# EAGLE design Fingerprint_UP_app (EAGLE 5.04)
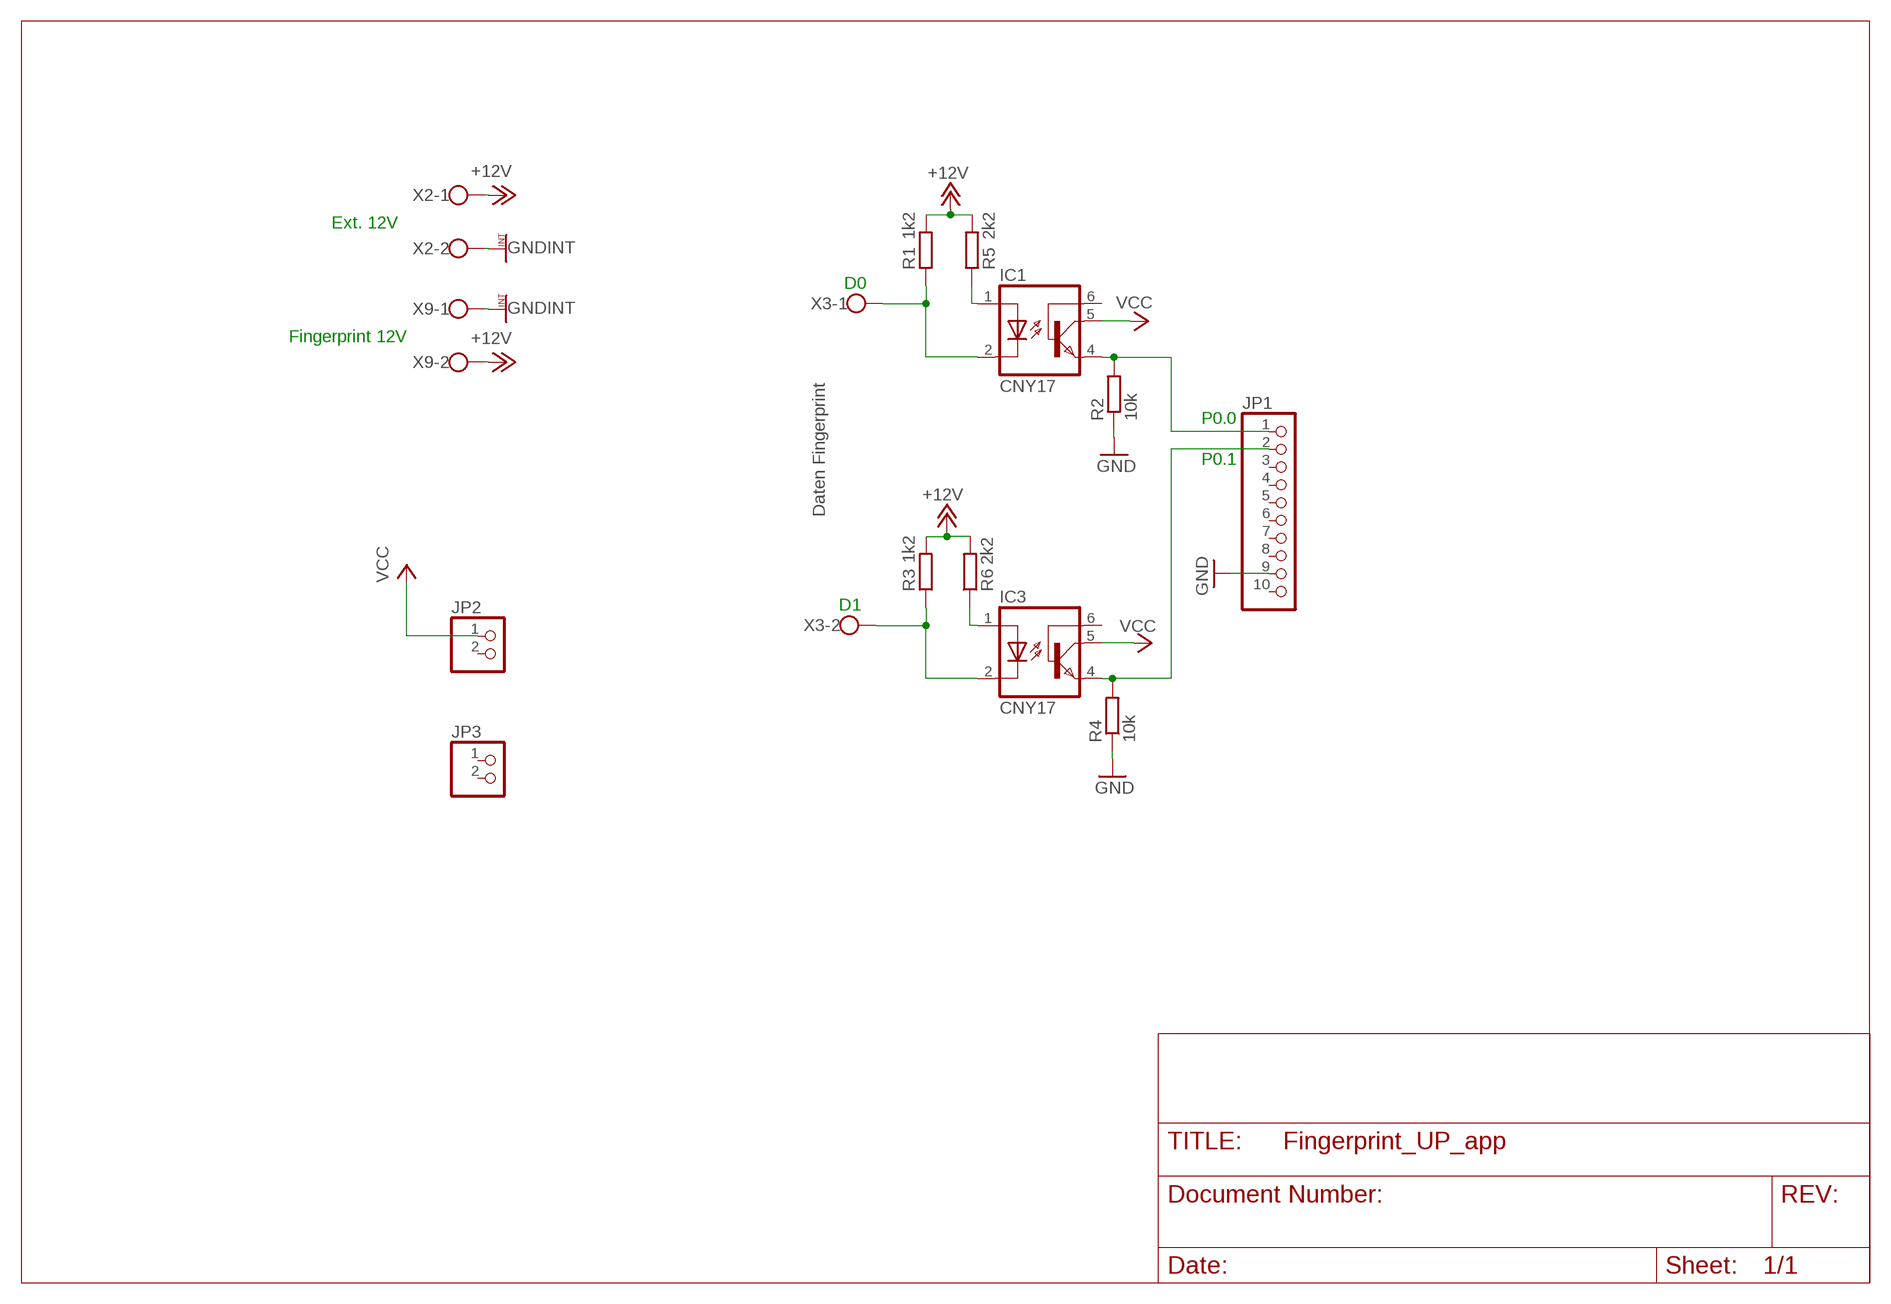
[diagram p0: schematic, sheet 1]

## Parts
IC1  CNY17  [DIL06]
IC3  CNY17  [DIL06]
JP1  PINHD-1X10  [1X10]
JP2  PINHD-1X2  [1X02]
JP3  PINHD-1X2  [1X02]
R1  1k2  R-EU_0204/7  [0204/7]
R2  10k  R-EU_0204/7  [0204/7]
R3  1k2  R-EU_0204/7  [0204/7]
R4  10k  R-EU_0204/7  [0204/7]
R5  2k2  R-EU_0204/7  [0204/7]
R6  2k2  R-EU_0204/7  [0204/7]
X2  12V Ext. In  W237-102  [W237-102]
X3  Daten Fingerprint  W237-102  [W237-102]
X9  12V Fingerprint  W237-102  [W237-102]

## Nets
+12V: R1.2 R3.2 R5.2 R6.2 X2.1 X9.2
GND: JP1.9 R2.1 R4.1
GNDINT: X2.2 X9.1
N$1: IC1.1(A) R5.1
N$2: IC3.1(A) R6.1
N$4: IC1.2(C) R1.1 X3.1
N$5: IC1.4(EMI) JP1.1 R2.2
N$10: IC3.2(C) R3.1 X3.2
N$13: IC3.4(EMI) JP1.2 R4.2
VCC: IC1.5(COL) IC3.5(COL) JP2.1
Unconnected: IC1.6(BAS) IC3.6(BAS) JP1.3 JP1.4 JP1.5 JP1.6 JP1.7 JP1.8 JP1.10 JP2.2 JP3.1 JP3.2

## Notes on the sheet
- Ext. 12V
- D0
- Fingerprint 12V
- P0.0
- P0.1
- D1

## Library data of the parts
IC1 IC3 = optocoupler:CNY17: SIEMENS OPTO COUPLER
JP1 = pinhead:PINHD-1X10: PIN HEADER
JP2 JP3 = pinhead:PINHD-1X2: PIN HEADER
R1-R6 = rcl:R-EU_: RESISTOR, European symbol
X2 X3 X9 = con-wago-500:W237-102: WAGO SCREW CLAMP

## Board
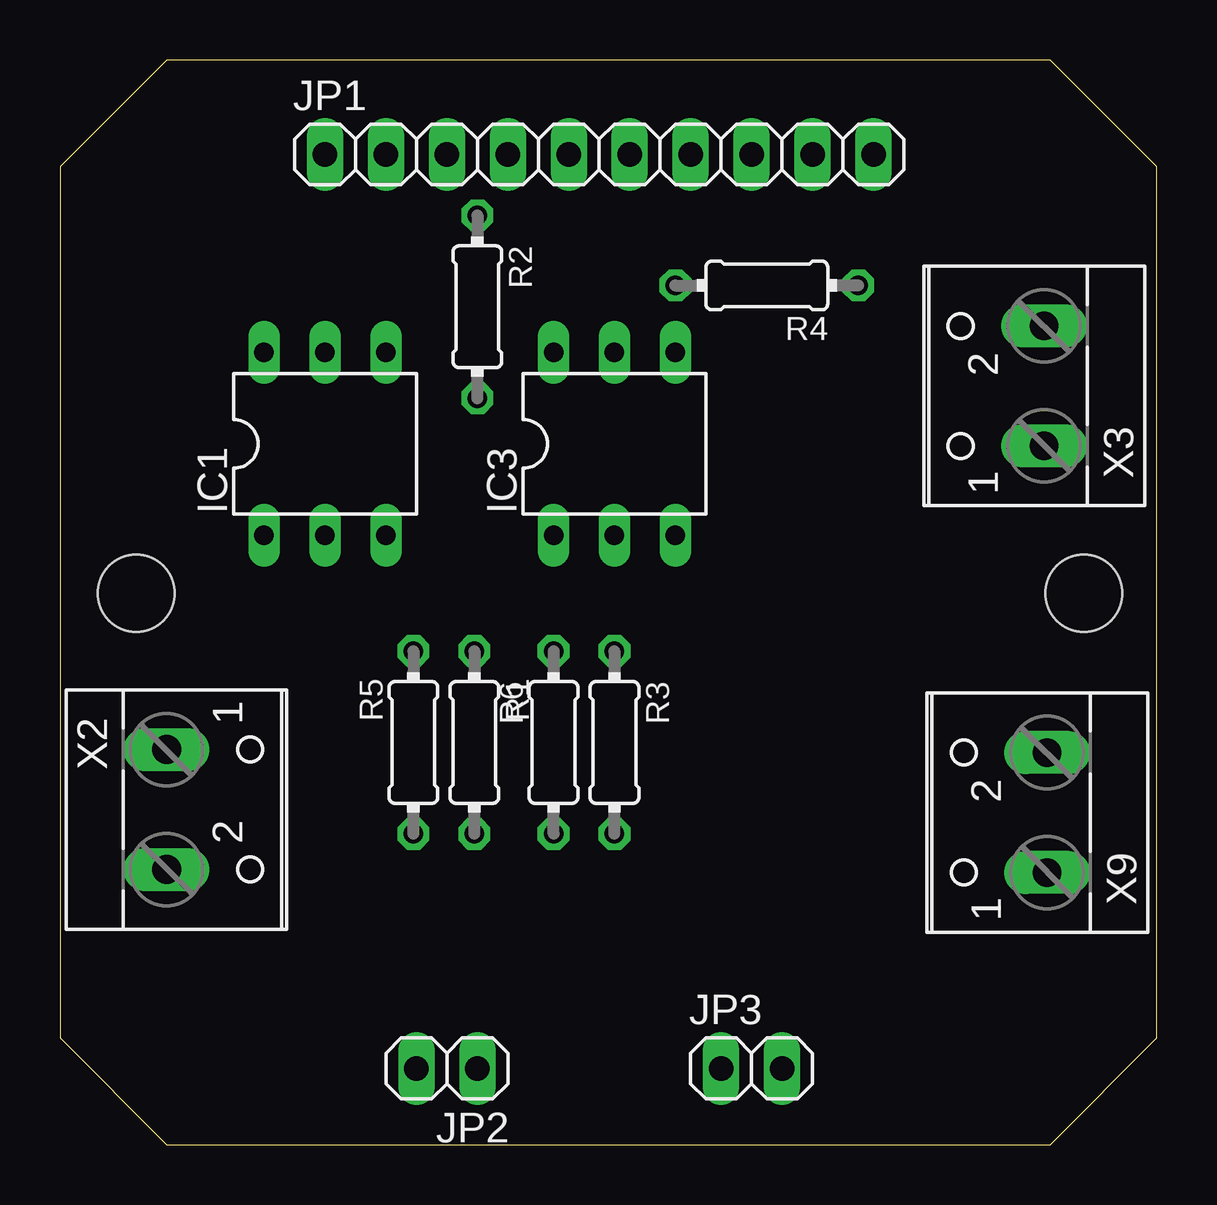
[diagram p1: board, top side]
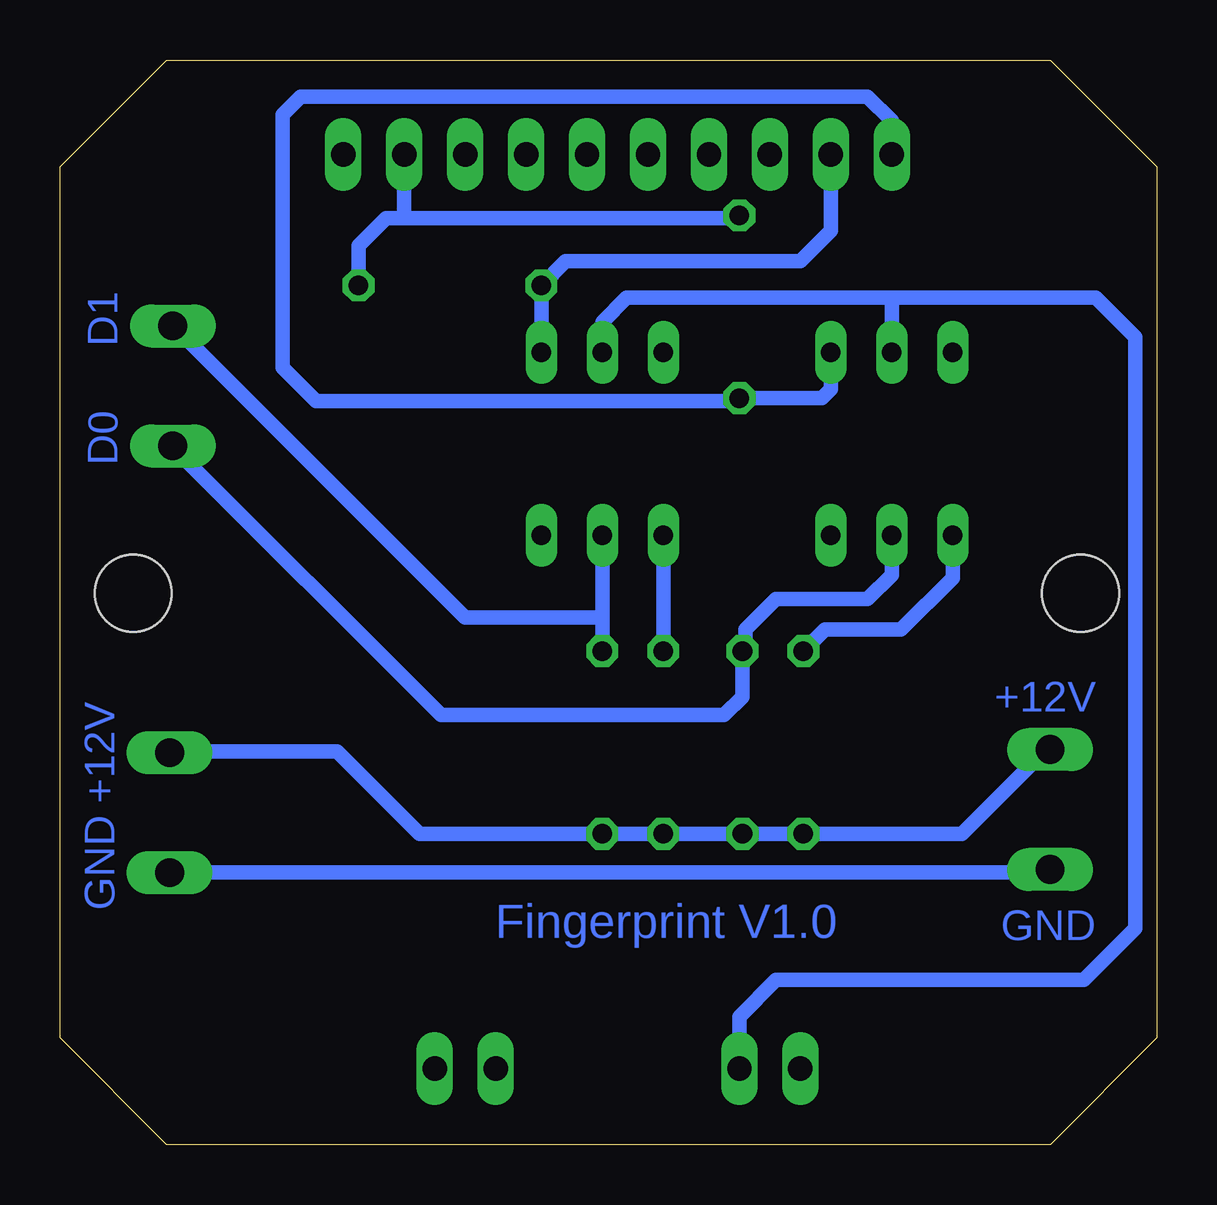
[diagram p2: board, bottom side, seen from below]

Size 45.72 x 45.21 mm. Coordinates in mm from the lower left corner, seen from the top.
Outline: 0,4.44 4.45,0 41.28,0 45.72,4.44 45.72,40.77 41.28,45.21 4.45,45.21 0,40.77 0,4.44
Copper layers (1*16): Top 0.035mm / dielectric 1.5mm / Bottom 0.035mm
Design rules "default *": minimum track width 10mil, minimum drill 24mil, track to track 16mil, track to pad 16mil, pad to pad 16mil, via to via 16mil, smd to smd 8mil, copper to edge 20mil, drill to drill 8mil, minimum pad ring 10mil, minimum via ring 8mil, stop-mask expansion 4mil, vias tented up to drill 0mil, thermal gap 10mil
Holes 3.2 mm at 3.18,22.99 42.67,22.99

### Footprints (pad centres in the part's own frame; a part is rotated, then mirrored left to right if it is on the bottom)
DIL06 = drill 0.813 long: 1 -2.54,-3.81; 2 0,-3.81; 3 2.54,-3.81; 4 2.54,3.81; 5 0,3.81; 6 -2.54,3.81
1X10 = drill 1.016 long: 1 -11.43,0; 2 -8.89,0; 3 -6.35,0; 4 -3.81,0; 5 -1.27,0; 6 1.27,0; 7 3.81,0; 8 6.35,0; 9 8.89,0; 10 11.43,0
1X02 = drill 1.016 long: 1 -1.27,0; 2 1.27,0
0204/7 = drill 0.813 octagon: 1 -3.81,0; 2 3.81,0
W237-102 = drill 1.194 long: 1 -2.5,-1.27; 2 2.5,-1.27

### Placement (x,y rotation side)
IC1  11.05,29.21 0 top
IC3  23.11,29.21 0 top
JP1  22.48,41.27 0 top
JP2  16.13,3.17 180 top
JP3  28.83,3.17 0 top
R1  17.27,16.76 270 top
R2  17.4,34.92 270 top
R3  23.11,16.76 270 top
R4  29.46,35.81 180 top
R5  14.73,16.76 270 top
R6  20.57,16.76 270 top
X2  5.72,13.97 270 top
X3  39.75,31.62 90 top
X9  39.88,13.84 90 top

### Tracks (layer width: path | path; a pad name or v marks a point on that pad's centre or on a via)
+12V
  Bottom 0.61: X9.2 41.06,16.34 41.02,16.38 34.16,16.38 30.73,12.95 R3.2 R6.2 R1.2 R5.2 8.13,12.95 4.45,16.64 X2.1
GND
  Bottom 0.61: R2.1 17.53,38.61 31.37,38.61 | 31.37,38.61 32.13,38.61 33.27,37.46 R4.1 | 31.37,38.61 JP1.9
GNDINT
  Bottom 0.61: X2.2 4.45,11.56 4.66,11.34 X9.1
N$1
  Bottom 0.61: R5.1 13.84,21.46 10.67,21.46 8.51,23.62 IC1.1
N$2
  Bottom 0.61: R6.1 IC3.1
N$4
  Bottom 0.61: IC1.2 11.05,23.75 12.06,22.73 15.88,22.73 17.14,21.46 17.14,20.7 R1.1 17.27,18.67 18.03,17.91 29.84,17.91 41.02,29.08 X3.1
N$5
  Bottom 0.61: JP1.1 11.05,42.67 12.06,43.69 35.69,43.69 36.45,42.93 36.45,32.38 35.05,30.99 17.53,30.99 R2.2 13.97,31.12 13.59,31.5 IC1.4
N$10
  Bottom 0.61: R3.1 23.11,21.97 | 23.11,21.97 IC3.2 | X3.2 41.02,34.16 28.83,21.97 23.11,21.97
N$13
  Bottom 0.61: JP1.2 13.59,38.1 14.86,36.83 24.64,36.83 R4.2 IC3.4
VCC
  Bottom 0.61: IC3.5 23.11,34.29 22.1,35.31 11.05,35.31 | 11.05,35.31 IC1.5 | JP2.1 17.4,5.33 15.88,6.86 3.05,6.86 0.89,9.02 0.89,33.66 2.54,35.31 11.05,35.31

### Text on the board
Bottom: D1 | D0 | +12V | +12V | GND | Fingerprint V1.0 | GND